# Altium schematic sheet RS485.SchDoc
size A3
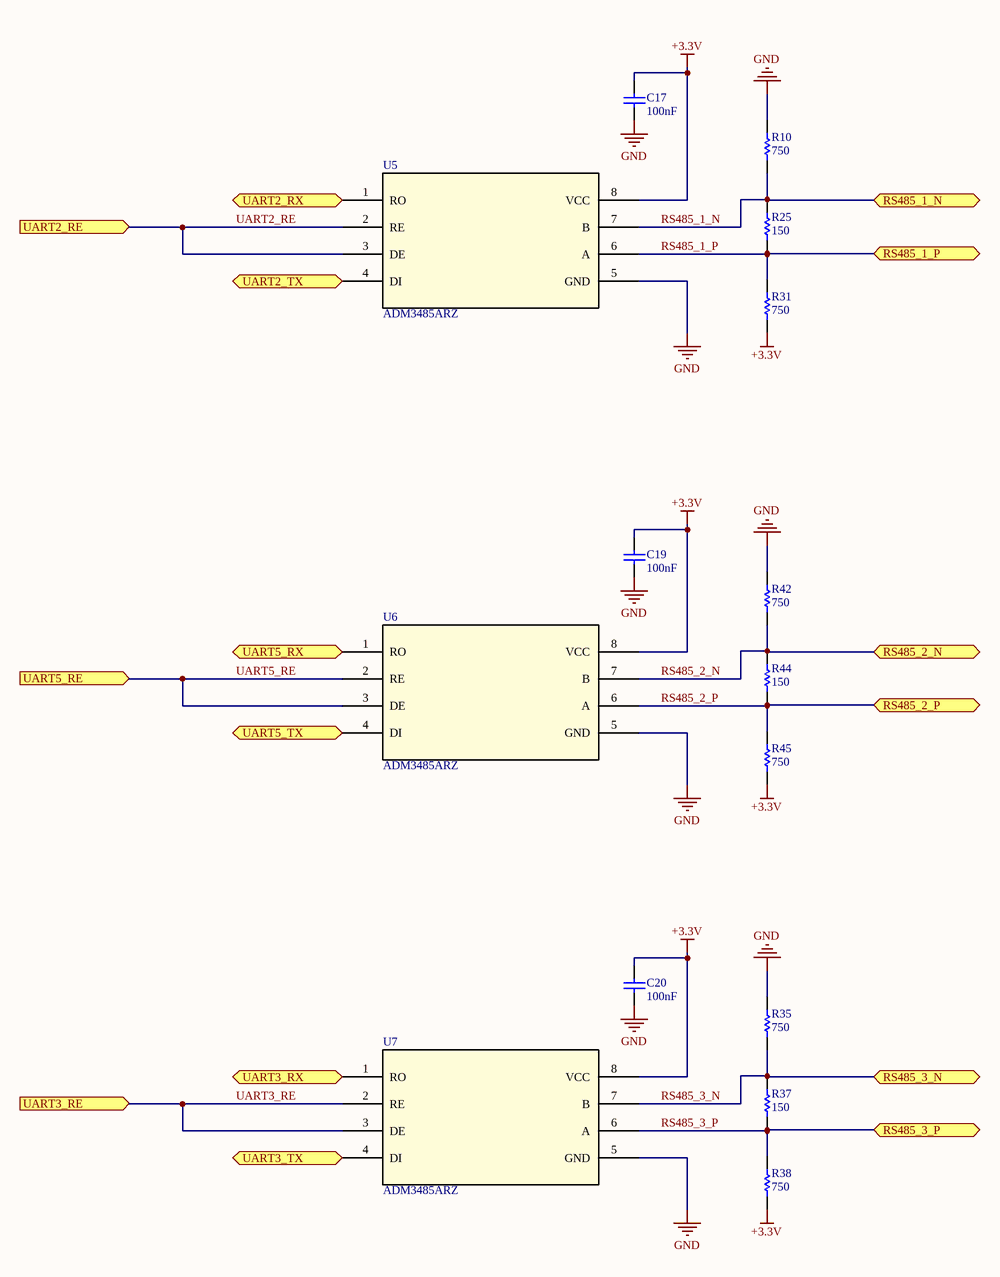
[diagram p0: RS485.SchDoc]

## Parts
C17  value 100nF  [C-805]  (hidden comment: C-805)
C19  value 100nF  [C-805]  (hidden comment: C-805)
C20  value 100nF  [C-805]  (hidden comment: C-805)
R10  value 750  [R-805]  (hidden comment: R-805)
R25  value 150  [R-805]  (hidden comment: R-805)
R31  value 750  [R-805]  (hidden comment: R-805)
R35  value 750  [R-805]  (hidden comment: R-805)
R37  value 150  [R-805]  (hidden comment: R-805)
R38  value 750  [R-805]  (hidden comment: R-805)
R42  value 750  [R-805]  (hidden comment: R-805)
R44  value 150  [R-805]  (hidden comment: R-805)
R45  value 750  [R-805]  (hidden comment: R-805)
U5  ADM3485ARZ  [R_8]
U6  ADM3485ARZ  [R_8]
U7  ADM3485ARZ  [R_8]

## Ports
RS485_1_N (bidir), RS485_1_P (bidir), RS485_2_N (bidir), RS485_2_P (bidir), RS485_3_N (bidir), RS485_3_P (bidir), UART2_RE (in), UART2_RX (out), UART2_TX (in), UART3_RE (in), UART3_RX (out), UART3_TX (in), UART5_RE (in), UART5_RX (out), UART5_TX (in)

## Nets
+3.3V: C17.2 C19.2 C20.2 R31.1 R38.1 R45.1 U5.8(VCC) U6.8(VCC) U7.8(VCC)
GND: C17.1 C19.1 C20.1 R10.2 R35.2 R42.2 U5.5(GND) U6.5(GND) U7.5(GND)
RS485_1_N: R10.1 R25.2 U5.7(B) ; port RS485_1_N
RS485_1_P: R25.1 R31.2 U5.6(A) ; port RS485_1_P
RS485_2_N: R42.1 R44.2 U6.7(B) ; port RS485_2_N
RS485_2_P: R44.1 R45.2 U6.6(A) ; port RS485_2_P
RS485_3_N: R35.1 R37.2 U7.7(B) ; port RS485_3_N
RS485_3_P: R37.1 R38.2 U7.6(A) ; port RS485_3_P
UART2_RE: U5.2(RE) U5.3(DE) ; port UART2_RE
UART2_RX: U5.1(RO) ; port UART2_RX
UART2_TX: U5.4(DI) ; port UART2_TX
UART3_RE: U7.2(RE) U7.3(DE) ; port UART3_RE
UART3_RX: U7.1(RO) ; port UART3_RX
UART3_TX: U7.4(DI) ; port UART3_TX
UART5_RE: U6.2(RE) U6.3(DE) ; port UART5_RE
UART5_RX: U6.1(RO) ; port UART5_RX
UART5_TX: U6.4(DI) ; port UART5_TX

## Library data of the parts
C17 C19 C20 = C-805: Capacitor; Published: 8-Jun-2000; LatestRevisionDate: 29-May-2009; LatestRevisionNote: IPC-7351 Footprint Added.; PackageReference: C1206; Publisher: Altium Limited; PackageDescription: Chip Capacitor
R10 R25 R31 R35 R37 R38 R42 R44 R45 = R-805: Resistor
U5-U7 = ADM3485ARZ: No Description Available; Vendor: Analog Devices Inc; Built_By: EMA_UL_Team; Manufacturer_Part_Number: ADM3485ARZ; Copyright: Copyright (C) 2018 Accelerated Designs. All rights reserved; RefDes: RefDes; Type: DEV; Value: Value